# EAGLE schematic light-meter-A (EAGLE 6.5.0)
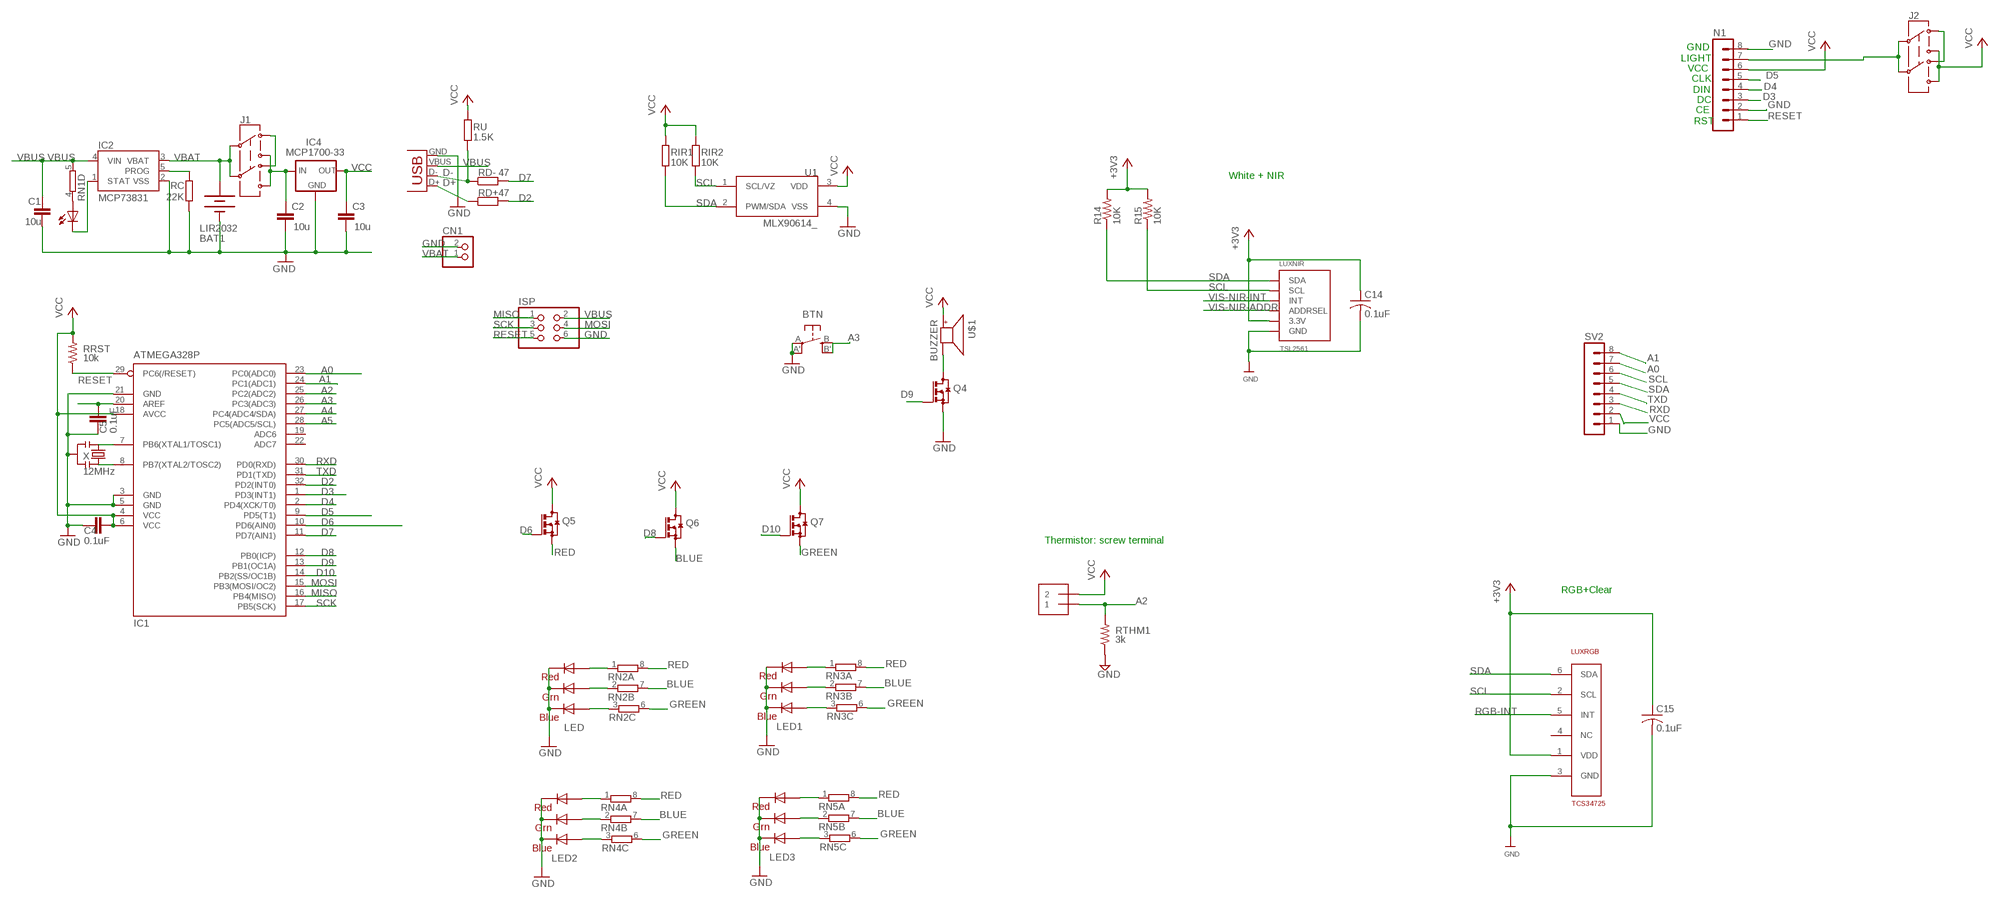
[diagram p0: schematic, sheet 1]

## Parts
BAT1  LIR2032  BATTERYBATTCOM_20MM_PTH_SMT  [BATTCOM_20MM_PTH_SMT]
BTN  EVQQ2  [EVQ-Q2]
C1  10u  C-EUC0805  [C0805]
C2  10u  C-EUC0805  [C0805]
C3  10u  C-EUC0805  [C0805]
C4  0.1uF  C-EUC0805  [C0805]
C5  0.1uF  C-EUC0805  [C0805]
C14  0.1uF  C-USC0805  [C0805]
C15  0.1uF  C-USC0805  [C0805]
CHG  0805  LEDCHIPLED_0805  [CHIPLED_0805]
CN1  JST_2PIN-SMT-RA  [JST-PH-2-SMT-RA]
IC1  ATMEGA328P  MEGA8-AI  [TQFP32-08]
IC2  MCP73831  [SOT23-5]
IC4  MCP1700-33  MCP1700SOT233  [SOT23]
ISP  PINHD-2X3  [2X03]
J1  AYZ0202  [AYZ0202]
J2  AYZ0202  [AYZ0202]
LED  RGBLED5050  [RGBLED5050]
LED1  RGBLED5050  [RGBLED5050]
LED2  RGBLED5050  [RGBLED5050]
LED3  RGBLED5050  [RGBLED5050]
LUXNIR  TSL2561  [TSL2561_FN@1]
LUXRGB  TCS34725  [DFN-6]
N1  MA08-1  [MA08-1]
Q4  BSS123  [SOT23]
Q5  BSS123  [SOT23]
Q6  BSS123  [SOT23]
Q7  BSS123  [SOT23]
R14  10K  R-US_R0805  [R0805]
R15  10K  R-US_R0805  [R0805]
RC  22K  R-EU_R0805  [R0805]
RD+  47  R-EU_R0805  [R0805]
RD-  47  R-EU_R0805  [R0805]
RIR1  10K  R-EU_R0805  [R0805]
RIR2  10K  R-EU_R0805  [R0805]
RN1  4R-NEXB38V  [EXB38V]
RN2  4R-NEXB38V  [EXB38V]
RN3  4R-NEXB38V  [EXB38V]
RN4  4R-NEXB38V  [EXB38V]
RN5  4R-NEXB38V  [EXB38V]
RRST  10k  R-US_R0805  [R0805@1]
RTHM1  3k  R-US_R0805  [R0805@1]
RU  1.5K  R-EU_R0805  [R0805]
SV2  MA08-1  [MA08-1]
THM1  1X2-3.5MM  [1X2-3.5MM]
U1  MLX90614_  [TO-39]
U$1  BUZZER  [SMT-8585-BUZZER]
X  12MHz  RESONATORSMD  [RESONATOR-SMD]
X1  USBSMD  [USB-MINIB]

## Nets
+3V3: C14.1 C15.1 LUXNIR.VDD(3.3V) LUXRGB.1(VDD) R14.2 R15.2
A0: IC1.23(PC0(ADC0)) SV2.7
A1: IC1.24(PC1(ADC1)) SV2.8
A2: IC1.25(PC2(ADC2)) RTHM1.2 THM1.1
A3: BTN.B'(S1) BTN.B(S) IC1.26(PC3(ADC3))
A4: IC1.27(PC4(ADC4/SDA))
A5: IC1.28(PC5(ADC5/SCL))
AREF: C5.2 IC1.20(AREF)
BLUE: Q6.2(S) RN2.7 RN3.7 RN4.7 RN5.7
D2: IC1.32(PD2(INT0)) RD+.2
D3: IC1.1(PD3(INT1)) N1.3
D4: IC1.2(PD4(XCK/T0)) N1.4
D5: IC1.9(PD5(T1)) N1.5
D6: IC1.10(PD6(AIN0)) Q5.1(G)
D7: IC1.11(PD7(AIN1)) RD-.2
D8: IC1.12(PB0(ICP)) Q6.1(G)
D9: IC1.13(PB1(OC1A)) Q4.1(G)
D10: IC1.14(PB2(SS/OC1B)) Q7.1(G)
D+: RD+.1 X1.D+
D-: RD-.1 RU.1 X1.D-
GND: BAT1.P$1(-) BTN.A'(P1) BTN.A(P) C1.2 C2.2 C3.2 C4.1 C5.1 C14.2 C15.2 CN1.2 IC1.3(GND) IC1.5(GND) IC1.21(GND) IC2.2(VSS) IC4.1(GND) ISP.6 LED1.4(BLUE_C) LED1.5(RED_C) LED1.6(GREEN_C) LED2.4(BLUE_C) LED2.5(RED_C) LED2.6(GREEN_C) LED3.4(BLUE_C) LED3.5(RED_C) LED3.6(GREEN_C) LED.4(BLUE_C) LED.5(RED_C) LED.6(GREEN_C) LUXNIR.VSS(GND) LUXRGB.3(GND) N1.2 N1.8 Q4.2(S) RC.1 RTHM1.1 SV2.1 U1.4(VSS) X1.GND X.2
GREEN: Q7.2(S) RN2.6 RN3.6 RN4.6 RN5.6
MISO: IC1.16(PB4(MISO)) ISP.1
MOSI: IC1.15(PB3(MOSI/OC2)) ISP.4
N$1: J1.3 J1.6
N$2: IC1.7(PB6(XTAL1/TOSC1)) X.1
N$3: IC1.8(PB7(XTAL2/TOSC2)) X.3
N$4: LED.3(BLUE_A) RN2.3
N$5: CHG.C IC2.1(STAT)
N$6: IC2.5(PROG) RC.2
N$7: Q4.3(D) U$1.-
N$8: J2.3 J2.6
N$9: LED.1(GREEN_A) RN2.2
N$10: CHG.A RN1.4
N$11: LED.2(RED_A) RN2.1
N$12: LED1.3(BLUE_A) RN3.3
N$13: LED1.1(GREEN_A) RN3.2
N$14: LED1.2(RED_A) RN3.1
N$15: LED2.3(BLUE_A) RN4.3
N$16: LED2.1(GREEN_A) RN4.2
N$17: LED2.2(RED_A) RN4.1
N$18: LED3.3(BLUE_A) RN5.3
N$19: LED3.1(GREEN_A) RN5.2
N$20: LED3.2(RED_A) RN5.1
RED: Q5.2(S) RN2.8 RN3.8 RN4.8 RN5.8
RESET: IC1.29(PC6(/RESET)) ISP.5 N1.1 RRST.1
RGB-INT: LUXRGB.5(INT)
RXD: IC1.30(PD0(RXD)) SV2.3
SCK: IC1.17(PB5(SCK)) ISP.3
SCL: LUXNIR.CLK(SCL) LUXRGB.2(SCL) R15.1 RIR2.1 SV2.6 U1.1(SCL/VZ)
SDA: LUXNIR.DATA(SDA) LUXRGB.6(SDA) R14.1 RIR1.1 SV2.5 U1.2(PWM/SDA)
TXD: IC1.31(PD1(TXD)) SV2.4
VBAT: BAT1.P$2(+) CN1.1 IC2.3(VBAT) J1.2 J1.5
VBAT1: J2.2 J2.5 N1.7
VBUS: C1.1 IC2.4(VIN) ISP.2 RN1.5 X1.VBUS
VCC: C3.1 C4.2 IC1.4(VCC) IC1.6(VCC) IC1.18(AVCC) IC4.2(OUT) J2.1 J2.4 N1.6 Q5.3(D) Q6.3(D) Q7.3(D) RIR1.2 RIR2.2 RRST.2 RU.2 SV2.2 THM1.2 U1.3(VDD) U$1.+
VDD: C2.1 IC4.3(IN) J1.1 J1.4
VIS-NIR-ADDR: LUXNIR.ADR(ADDRSEL)
VIS-NIR-INT: LUXNIR.INT
Unconnected: IC1.19(ADC6) IC1.22(ADC7) LUXRGB.4(NC) RN1.1 RN1.2 RN1.3 RN1.6 RN1.7 RN1.8 RN2.4 RN2.5 RN3.4 RN3.5 RN4.4 RN4.5 RN5.4 RN5.5

## Notes on the sheet
- GND
- LIGHT
- VCC
- CLK
- DIN
- DC
- CE
- RST
- White + NIR
- Thermistor: screw terminal
- RGB+Clear

## Library data of the parts
BAT1 = SparkFunNew:BATTERY: Battery Holders Various common sizes : AA, AAA, 20mm coin cell and 12mm coin cell.
BTN = adafruit:EVQQ2: SMT 6mm switch, EVQQ2 series http://www.ladyada.net/library/eagle
C1-C3 = resistor:C-EU: CAPACITOR, European symbol
C4 C5 = rcl:C-EU: CAPACITOR, European symbol
C14 C15 = adafruit:C-US: CAPACITOR, American symbol
CHG = led:LED: LED OSRAM: - CHIPLED LG R971, LG N971, LY N971, LG Q971, LY Q971, LO R971, LY R971 LH N974, LH R974 LS Q976, LO Q976, LY Q976 LO Q996 - Hyper CHIPLED LW Q18S LB Q993, LB Q99A, LB R99A - SideLED LS A670, LO A670, LY A670, LG A670, LP A670 LB A673, LV A673, LT A673, LW A673 LH A674 LY A675 LS A676, LA A676, LO A676, LY A676, LW A676 LS A679, LY A679, LG A679 - Hyper Micro SIDELED® LS Y876, LA Y876, LO Y876, LY Y876 LT Y87S - SmartLED LW L88C, LW L88S LB L89C, LB L89S, LG L890 LS L89K, LO L89K, LY L89K LS L896, LA L896, LO L896, LY L896 - TOPLED LS T670, LO T670, LY T670, LG T670, LP T670 LSG T670, LSP T670, LSY T670, LOP T670, LYG T670 LG T671, LOG T671, LSG T671 LB T673, LV T673, LT T673, LW T673 LH T674 LS T676, LA T676, LO T676, LY T676, LB T676, LH T676, LSB T676, LW T676 LB T67C, LV T67C, LT T67C, LS T67K, LO T67K, LY T67K, LW E67C LS E67B, LA E67B, LO E67B, LY E67B, LB E67C, LV E67C, LT E67C LW T67C LS T679, LY T679, LG T679 LS T770, LO T770, LY T770, LG T770, LP T770 LB T773, LV T773, LT T773, LW T773 LH T774 LS E675, LA E675, LY E675, LS T675 LS T776, LA T776, LO T776, LY T776, LB T776 LHGB T686 LT T68C, LB T68C - Hyper Mini TOPLED® LB M676 - Mini TOPLED Santana® LG M470 LS M47K, LO M47K, LY M47K Source: http://www.osram.convergy.de LUXEON: - LUMILED® LXK2-PW12-R00, LXK2-PW12-S00, LXK2-PW14-U00, LXK2-PW14-V00 LXK2-PM12-R00, LXK2-PM12-S00, LXK2-PM14-U00 LXK2-PE12-Q00, LXK2-PE12-R00, LXK2-PE12-S00, LXK2-PE14-T00, LXK2-PE14-U00 LXK2-PB12-K00, LXK2-PB12-L00, LXK2-PB12-M00, LXK2-PB14-N00, LXK2-PB14-P00, LXK2-PB14-Q00 LXK2-PR12-L00, LXK2-PR12-M00, LXK2-PR14-Q00, LXK2-PR14-R00 LXK2-PD12-Q00, LXK2-PD12-R00, LXK2-PD12-S00 LXK2-PH12-R00, LXK2-PH12-S00 LXK2-PL12-P00, LXK2-PL12-Q00, LXK2-PL12-R00 Source: www.luxeon.com KINGBRIGHT: KA-3528ASYC Source: www.kingbright.com
CN1 = adafruit:JST_2PIN: JST 2-Pin Connectors of various flavors SMT-RA (S2B-PH-SM4) 4UConnector #17311 SMT (B2B-PH-SM4) THM-RA (S2B-PH) THM (B2B-PH)
IC1 = atmel:MEGA8: MICROCONTROLLER 8 Kbytes FLASH, 1 kbytes SRAM, 512 bytes EEPROM, USART, 6-channel 10 bit ADC, 2-channel 8 bit ADC Pin compatible with Atmega48, ATMega88, ATMega168 Source: avr.lbr; MPN: ATMEGA8-16AU; OC_FARNELL: 9171371; OC_NEWARK: 73M8863
IC2 = SparkFunNew:MCP73831: Microchip's MCP73831 Miniature single cell, fully integrated Li-Ion, Li-polymer charge management controller http://ww1.microchip.com/downloads/en/DeviceDoc/21984a.pdf
IC4 = adafruit:MCP1700: VOLTAGE REGULATOR
ISP = pinhead:PINHD-2X3: PIN HEADER
J1 J2 = SparkFunNew:AYZ0202: SPDT Slide Switch Simple SMD single-pull double-throw slide switch. Good for less than 350mA power switch, switching UARTs between devices, etc. Spark Fun Electronics SKU : COM-00597
LED LED1-LED3 = adafruit:RGBLED: For 5050 RGB LEDs, the order of the LEDs may vary from one manufacturer to another!
LUXNIR = microbuilder:TSL2561: TSL2561 Light-To-Digital Sensor Mouser Part Numbers: CS (obsolete): 856-TSL2561CS DFN (cheapest): 856-TSL2561FN
LUXRGB = dwbLibrary:TCS34725
N1 SV2 = con-lstb:MA08-1: PIN HEADER; OC_FARNELL: unknown; OC_NEWARK: unknown
Q4-Q7 = transistor-small-signal:BSS123: N-CHANNEL MOS FET
R14 R15 = adafruit:R-US_: RESISTOR, American symbol
RC RD+ RD- RIR1 RIR2 RU = rcl:R-EU_: RESISTOR, European symbol
RN1-RN5 = resistor-dil:4R-N: Array Chip Resistor Source: RS Component / Phycomp; OC_FARNELL: unknown; OC_NEWARK: unknown
RRST RTHM1 = rcl:R-US_: RESISTOR, American symbol
THM1 = adafruit:1X2: 3.5mm Terminal block http://www.ladyada.net/library/pcb/eaglelibrary.html
U1 = SparkFun:MLX90614: Melexis IR Thermometer
U$1 = adafruit:BUZZER
X = SparkFunNew:RESONATOR: Resonator Small SMD resonator. This is the itty bitty 10/20MHz resonators with built in caps. CSTCE10M0G55 and CSTCE20M0V53. Footprint has been reviewed closely but hasn't been tested yet.
X1 = SparkFun:USB: USB Connectors USB-B-PTH is fully proven SKU : PRT-00139 USB-miniB is fully proven SKU : PRT-00587 USB-A-PCB is untested. USB-A-H is throughly reviewed, but untested. Spark Fun Electronics SKU : PRT-00437 USB-B-SMT is throughly reviewed, but untested. Needs silkscreen touching up. USB-A-S has not been used/tested USB-MB-H has not been used/tested

## Net classes
0 default: width 0.203 mm, clearance 0.203 mm
1 power: width 0.254 mm, clearance 0.203 mm